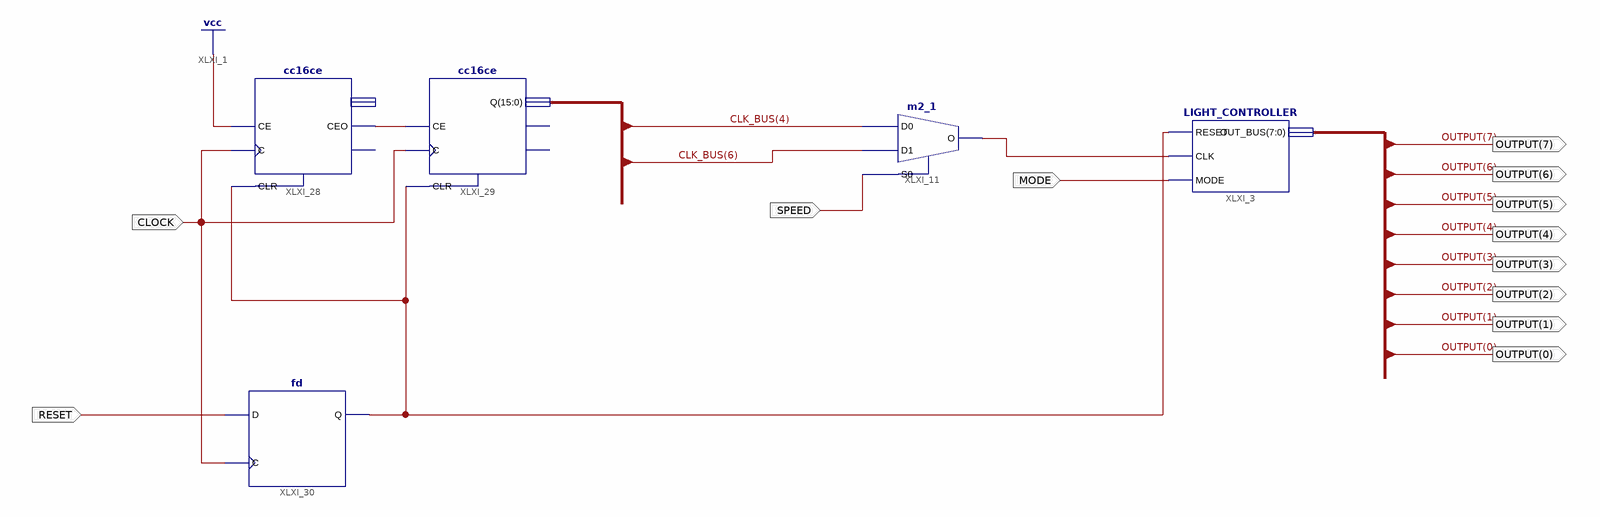
[diagram p0: schematic sheet 1]
// Xilinx ISE schematic TOP_SCHEMA.sch (spartan3a) as structural Verilog: 5 symbols, 12 ports
module TOP_SCHEMA (
  input  CLOCK,
  input  MODE,
  input  RESET,
  input  SPEED,
  output [7:0] OUTPUT
);

  wire XLXN_34, XLXN_121, XLXN_131;
  wire [15:0] CLK_BUS;

  m2_1 XLXI_11 (.D0(CLK_BUS[4]), .D1(CLK_BUS[6]), .S0(SPEED), .O(XLXN_131));
  LIGHT_CONTROLLER XLXI_3 (.RESET(XLXN_121), .CLK(XLXN_131), .MODE(MODE), .OUT_BUS(OUTPUT));
  cc16ce XLXI_28 (.C(CLOCK), .CE(1'b1), .CLR(XLXN_121), .CEO(XLXN_34));  // open: Q, TC
  cc16ce XLXI_29 (.C(CLOCK), .CE(XLXN_34), .CLR(XLXN_121), .Q(CLK_BUS));  // open: CEO, TC
  fd XLXI_30 (.C(CLOCK), .D(RESET), .Q(XLXN_121));
endmodule
